# EAGLE schematic half (EAGLE 9.0.0)
COMPANY: ADAFRUIT INDUSTRIES; DRAWN: KTOWN; REV: B

## Sheet 1 of 3
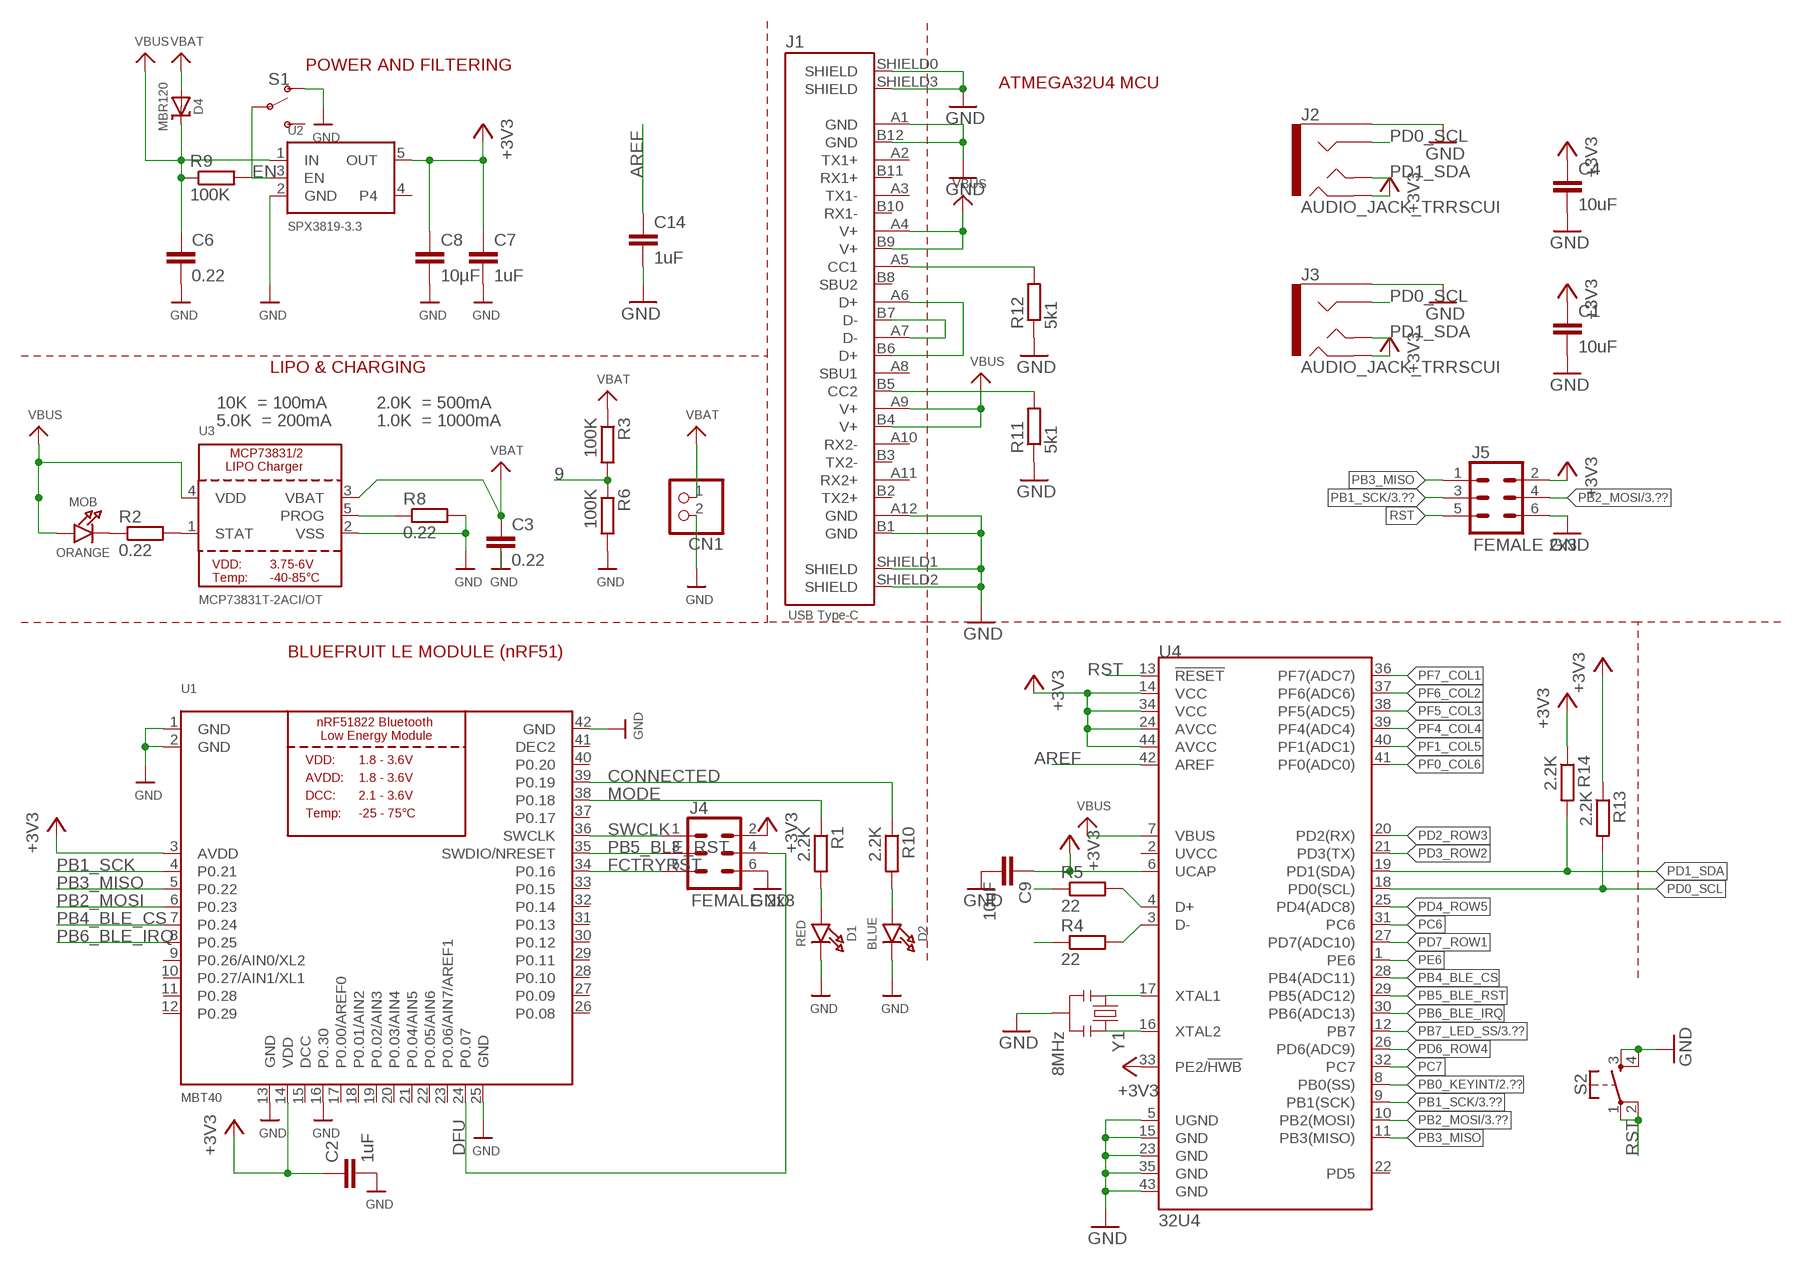
[diagram p0: schematic, sheet 1]

### Parts
C1  10uF  C-EUC0805  [C0805]
C2  1uF  C-EUC0805  [C0805]
C3  0.22  C-EUC0805  [C0805]
C4  10uF  C-EUC0805  [C0805]
C6  0.22  C-EUC0805  [C0805]
C7  1uF  C-EUC0805  [C0805]
C8  10µF  C-EUC0805  [C0805]
C9  10uF  C-EUC0805  [C0805]
C14  1uF  C-EUC0805  [C0805]
CN1  JST_2PIN-SMT-RA  [JST-PH-2-SMT-RA]
D1  RED  LED0805_NOOUTLINE  [CHIPLED_0805_NOOUTLINE]
D2  BLUE  LED0805_NOOUTLINE  [CHIPLED_0805_NOOUTLINE]
D4  MBR120  DIODE-SCHOTTKYSOD-123  [SOD-123]
J1  DX07S024JJ2_USB_TYPE-C  [DX07S0224JJ2_USB-C]
J2  AUDIO_JACK_TRRSCUI  [AUDIO_JACK_3.5MM_TRRS_SMD_CUI]
J3  AUDIO_JACK_TRRSCUI  [AUDIO_JACK_3.5MM_TRRS_SMD_CUI]
J4  FEMALE 2x3  CONN_03X2FEMALE  [2X3]
J5  FEMALE 2x3  CONN_03X2FEMALE  [2X3]
MOB  ORANGE  LED0805_NOOUTLINE  [CHIPLED_0805_NOOUTLINE]
R1  2.2K  R-EU_R0805  [R0805]
R2  0.22  R-EU_R0805  [R0805]
R3  100K  R-EU_R0805  [R0805]
R4  22  R-EU_R0805  [R0805]
R5  22  R-EU_R0805  [R0805]
R6  100K  R-EU_R0805  [R0805]
R8  0.22  R-EU_R0805  [R0805]
R9  100K  R-EU_R0805  [R0805]
R10  2.2K  R-EU_R0805  [R0805]
R11  5k1  R-EU_R0805  [R0805]
R12  5k1  R-EU_R0805  [R0805]
R13  2.2K  R-EU_R0805  [R0805]
R14  2.2K  R-EU_R0805  [R0805]
S1  SWITCH-SPDT-SMD-RIGHT-ANGLE  [SWITCH_SPST_SMD_A]
S2  MOMENTARY-SWITCH-SPST-2-SMD-5.2MM  [TACTILE_SWITCH_SMD_5.2MM]
U1  MBT40  NRF51822_MODULE_MDBT40  [BLE_MODULE_RAYTAC_MDBT40]
U2  SPX3819-3.3  VREG_SOT23-5  [SOT23-5]
U3  MCP73831T-2ACI/OT  MCP73831/2  [SOT23-5]
U4  32U4  ATMEGA32U4TQFP-44  [TQFP44]
Y1  8MHz  RESONATORSMD  [RESONATOR-SMD]

### Nets
9: R3.2 R6.1
+3V3: C1.1 C2.1 C4.1 C7.1 C8.1 C9.1 J2.RING2 J3.RING2 J4.2 J5.2 R13.1 R14.1 U1.3(AVDD) U1.14(VDD) U2.5(OUT) U4.6(UCAP) U4.14(VCC) U4.24(AVCC) U4.33(PE2/!HWB) U4.34(VCC) U4.44(AVCC) ; also sheet 2,3
AREF: C14.1 U4.42(AREF)
CONNECTED: R10.1 U1.39(P0.19)
D++: J1.A6(D+) J1.B6(D+) R5.1
D--: J1.A7(D-) J1.B7(D-) R4.1
DFU: J4.4 U1.24(P0.07)
EN: R9.2 S1.2(P) U2.3(EN)
FCTRYRST: J4.5 U1.34(P0.16)
GND: C1.2 C2.2 C3.2 C4.2 C6.2 C7.2 C8.2 C9.2 C14.2 CN1.2 D1.C D2.C J1.A1(GND) J1.A12(GND) J1.B1(GND) J1.B12(GND) J1.SHIELD0(SHIELD) J1.SHIELD1(SHIELD) J1.SHIELD2(SHIELD) J1.SHIELD3(SHIELD) J2.EARTH J3.EARTH J4.6 J5.6 R6.2 R8.2 R11.1 R12.1 S1.1(O) S2.3 S2.4 U1.1(GND) U1.2(GND) U1.13(GND) U1.16(P0.30) U1.25(GND) U1.42(GND) U2.2(GND) U3.2(VSS) U4.5(UGND) U4.15(GND) U4.23(GND) U4.35(GND) U4.43(GND) Y1.2 ; also sheet 3
MODE: R1.1 U1.38(P0.18)
N$1: MOB.C R2.1
N$3: R2.2 U3.1(STAT)
N$4: R8.1 U3.5(PROG)
N$5: D1.A R1.2
N$6: D2.A R10.2
N$7: U4.17(XTAL1) Y1.1
N$8: U4.16(XTAL2) Y1.3
N$9: R5.2 U4.4(D+)
N$10: R4.2 U4.3(D-)
N$11: J1.A5(CC1) R12.2
N$12: J1.B5(CC2) R11.2
PB0_KEYINT: U4.8(PB0(SS)) ; also sheet 2
PB1_SCK: J5.3 U1.4(P0.21) U4.9(PB1(SCK)) ; also sheet 3
PB2_MOSI: J5.4 U1.6(P0.23) U4.10(PB2(MOSI)) ; also sheet 3
PB3_MISO: J5.1 U1.5(P0.22) U4.11(PB3(MISO))
PB4_BLE_CS: U1.7(P0.24) U4.28(PB4(ADC11))
PB5_BLE_RST: J4.3 U1.35(SWDIO/NRESET) U4.29(PB5(ADC12))
PB6_BLE_IRQ: U1.8(P0.25) U4.30(PB6(ADC13))
PB7_LED_SS: U4.12(PB7) ; also sheet 3
PC6: U4.31(PC6)
PC7: U4.32(PC7)
PD0_SCL: J2.RING1 J3.RING1 R13.2 U4.18(PD0(SCL))
PD1_SDA: J2.TIP J3.TIP R14.2 U4.19(PD1(SDA))
PD2_ROW3: U4.20(PD2(RX)) ; also sheet 2
PD3_ROW2: U4.21(PD3(TX)) ; also sheet 2
PD4_ROW5: U4.25(PD4(ADC8)) ; also sheet 2
PD6_ROW4: U4.26(PD6(ADC9)) ; also sheet 2
PD7_ROW1: U4.27(PD7(ADC10)) ; also sheet 2
PE6: U4.1(PE6)
PF0_COL6: U4.41(PF0(ADC0)) ; also sheet 2
PF1_COL5: U4.40(PF1(ADC1)) ; also sheet 2
PF4_COL4: U4.39(PF4(ADC4)) ; also sheet 2
PF5_COL3: U4.38(PF5(ADC5)) ; also sheet 2
PF6_COL2: U4.37(PF6(ADC6)) ; also sheet 2
PF7_COL1: U4.36(PF7(ADC7)) ; also sheet 2
RST: J5.5 S2.1 S2.2 U4.13(!RESET)
SWCLK: J4.1 U1.36(SWCLK)
VBAT: C3.1 CN1.1 D4.A R3.1 U3.3(VBAT)
VBUS: C6.1 D4.C J1.A4(V+) J1.A9(V+) J1.B4(V+) J1.B9(V+) MOB.A R9.1 U2.1(IN) U3.4(VDD) U4.7(VBUS)
Unconnected: J1.A2(TX1+) J1.A3(TX1-) J1.A8(SBU1) J1.A10(RX2-) J1.A11(RX2+) J1.B2(TX2+) J1.B3(TX2-) J1.B8(SBU2) J1.B10(RX1-) J1.B11(RX1+) S1.3(S) U1.9(P0.26/AIN0/XL2) U1.10(P0.27/AIN1/XL1) U1.11(P0.28) U1.12(P0.29) U1.17(P0.00/AREF0) U1.18(P0.01/AIN2) U1.19(P0.02/AIN3) U1.20(P0.03/AIN4) U1.21(P0.04/AIN5) U1.22(P0.05/AIN6) U1.23(P0.06/AIN7/AREF1) U1.26(P0.08) U1.27(P0.09) U1.28(P0.10) U1.29(P0.11) U1.30(P0.12) U1.31(P0.13) U1.32(P0.14) U1.33(P0.15) U1.37(P0.17) U1.40(P0.20) U2.4 U4.2(UVCC) U4.22(PD5)

### Notes on the sheet
- POWER AND FILTERING
- ATMEGA32U4 MCU
- LIPO & CHARGING
- 10K  = 100mA | 2.0K  = 500mA
- 5.0K  = 200mA | 1.0K  = 1000mA
- BLUEFRUIT LE MODULE (nRF51)

## Sheet 2 of 3
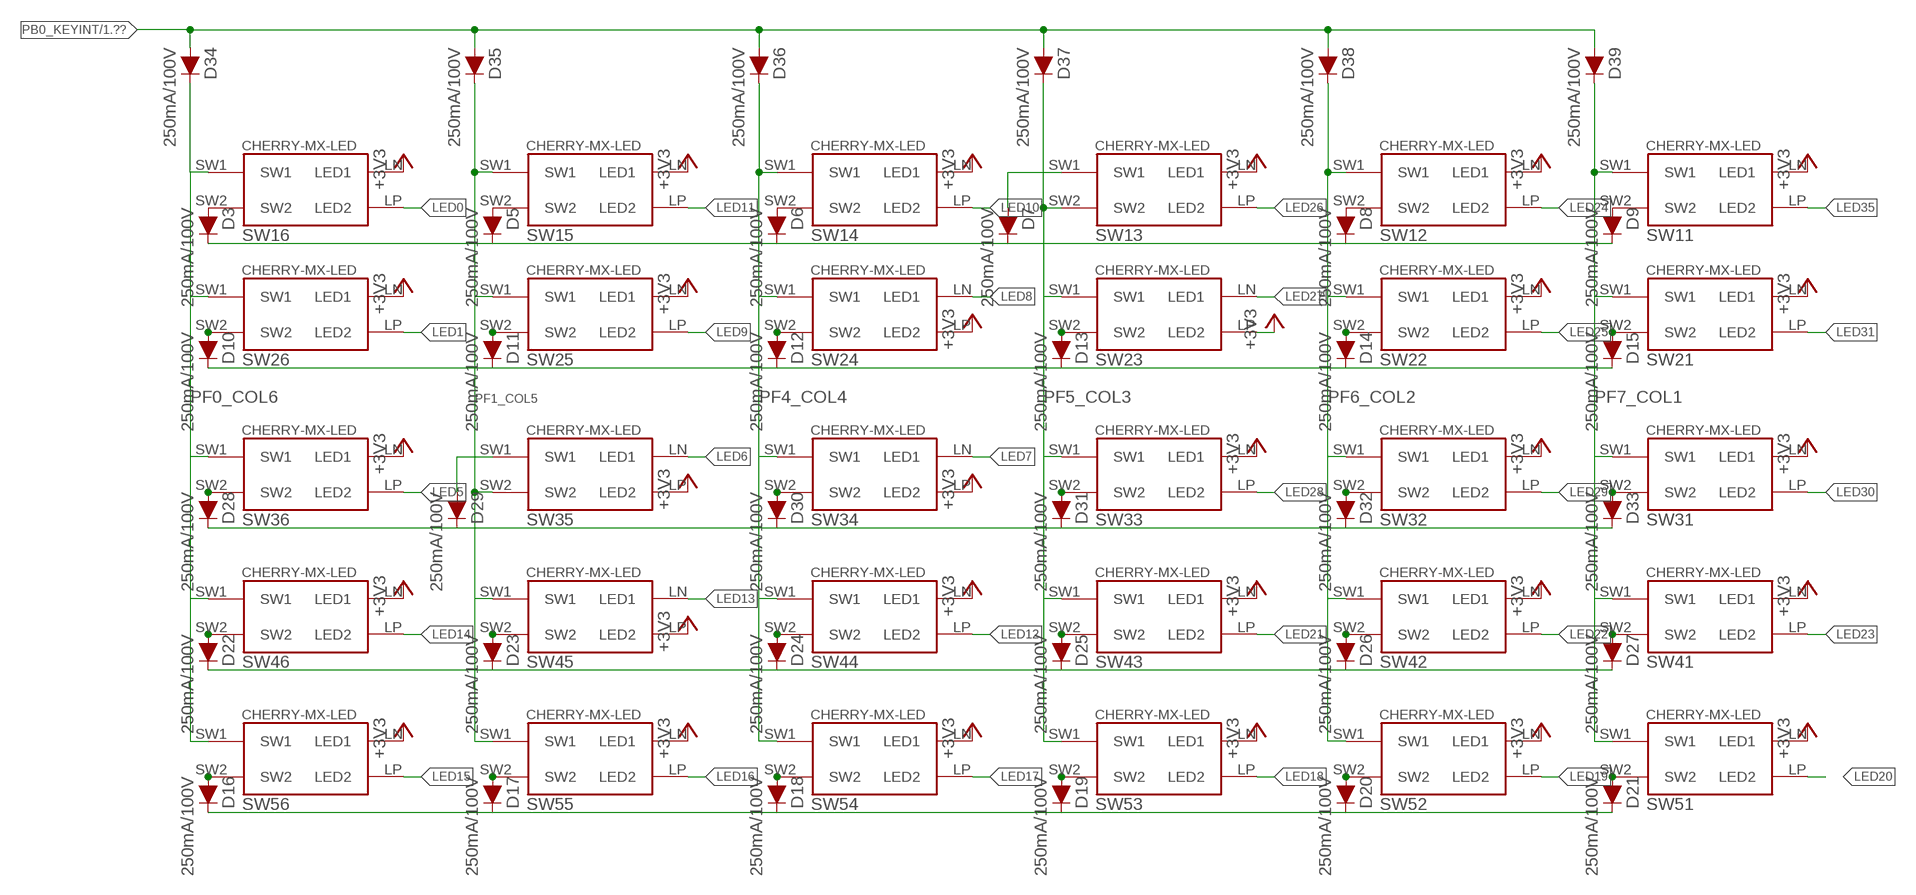
[diagram p1: schematic, sheet 2]

### Parts
D3  250mA/100V  DIODE-BAS16J  [SOD-323]
D5  250mA/100V  DIODE-BAS16J  [SOD-323]
D6  250mA/100V  DIODE-BAS16J  [SOD-323]
D7  250mA/100V  DIODE-BAS16J  [SOD-323]
D8  250mA/100V  DIODE-BAS16J  [SOD-323]
D9  250mA/100V  DIODE-BAS16J  [SOD-323]
D10  250mA/100V  DIODE-BAS16J  [SOD-323]
D11  250mA/100V  DIODE-BAS16J  [SOD-323]
D12  250mA/100V  DIODE-BAS16J  [SOD-323]
D13  250mA/100V  DIODE-BAS16J  [SOD-323]
D14  250mA/100V  DIODE-BAS16J  [SOD-323]
D15  250mA/100V  DIODE-BAS16J  [SOD-323]
D16  250mA/100V  DIODE-BAS16J  [SOD-323]
D17  250mA/100V  DIODE-BAS16J  [SOD-323]
D18  250mA/100V  DIODE-BAS16J  [SOD-323]
D19  250mA/100V  DIODE-BAS16J  [SOD-323]
D20  250mA/100V  DIODE-BAS16J  [SOD-323]
D21  250mA/100V  DIODE-BAS16J  [SOD-323]
D22  250mA/100V  DIODE-BAS16J  [SOD-323]
D23  250mA/100V  DIODE-BAS16J  [SOD-323]
D24  250mA/100V  DIODE-BAS16J  [SOD-323]
D25  250mA/100V  DIODE-BAS16J  [SOD-323]
D26  250mA/100V  DIODE-BAS16J  [SOD-323]
D27  250mA/100V  DIODE-BAS16J  [SOD-323]
D28  250mA/100V  DIODE-BAS16J  [SOD-323]
D29  250mA/100V  DIODE-BAS16J  [SOD-323]
D30  250mA/100V  DIODE-BAS16J  [SOD-323]
D31  250mA/100V  DIODE-BAS16J  [SOD-323]
D32  250mA/100V  DIODE-BAS16J  [SOD-323]
D33  250mA/100V  DIODE-BAS16J  [SOD-323]
D34  250mA/100V  DIODE-BAS16J  [SOD-323]
D35  250mA/100V  DIODE-BAS16J  [SOD-323]
D36  250mA/100V  DIODE-BAS16J  [SOD-323]
D37  250mA/100V  DIODE-BAS16J  [SOD-323]
D38  250mA/100V  DIODE-BAS16J  [SOD-323]
D39  250mA/100V  DIODE-BAS16J  [SOD-323]
SW11  CHERRY-MX-LEDSMD  [CHERRY-MX-PM-SMDLED]
SW12  CHERRY-MX-LEDSMD  [CHERRY-MX-PM-SMDLED]
SW13  CHERRY-MX-LEDSMD  [CHERRY-MX-PM-SMDLED]
SW14  CHERRY-MX-LEDSMD  [CHERRY-MX-PM-SMDLED]
SW15  CHERRY-MX-LEDSMD  [CHERRY-MX-PM-SMDLED]
SW16  CHERRY-MX-LEDSMD  [CHERRY-MX-PM-SMDLED]
SW21  CHERRY-MX-LEDSMD  [CHERRY-MX-PM-SMDLED]
SW22  CHERRY-MX-LEDSMD  [CHERRY-MX-PM-SMDLED]
SW23  CHERRY-MX-LEDSMD  [CHERRY-MX-PM-SMDLED]
SW24  CHERRY-MX-LEDSMD  [CHERRY-MX-PM-SMDLED]
SW25  CHERRY-MX-LEDSMD  [CHERRY-MX-PM-SMDLED]
SW26  CHERRY-MX-LEDSMD  [CHERRY-MX-PM-SMDLED]
SW31  CHERRY-MX-LEDSMD  [CHERRY-MX-PM-SMDLED]
SW32  CHERRY-MX-LEDSMD  [CHERRY-MX-PM-SMDLED]
SW33  CHERRY-MX-LEDSMD  [CHERRY-MX-PM-SMDLED]
SW34  CHERRY-MX-LEDSMD  [CHERRY-MX-PM-SMDLED]
SW35  CHERRY-MX-LEDSMD  [CHERRY-MX-PM-SMDLED]
SW36  CHERRY-MX-LEDSMD  [CHERRY-MX-PM-SMDLED]
SW41  CHERRY-MX-LEDSMD  [CHERRY-MX-PM-SMDLED]
SW42  CHERRY-MX-LEDSMD  [CHERRY-MX-PM-SMDLED]
SW43  CHERRY-MX-LEDSMD  [CHERRY-MX-PM-SMDLED]
SW44  CHERRY-MX-LEDSMD  [CHERRY-MX-PM-SMDLED]
SW45  CHERRY-MX-LEDSMD  [CHERRY-MX-PM-SMDLED]
SW46  CHERRY-MX-LEDSMD  [CHERRY-MX-PM-SMDLED]
SW51  CHERRY-MX-LEDSMD  [CHERRY-MX-PM-SMDLED]
SW52  CHERRY-MX-LEDSMD  [CHERRY-MX-PM-SMDLED]
SW53  CHERRY-MX-LEDSMD  [CHERRY-MX-PM-SMDLED]
SW54  CHERRY-MX-LEDSMD  [CHERRY-MX-PM-SMDLED]
SW55  CHERRY-MX-LEDSMD  [CHERRY-MX-PM-SMDLED]
SW56  CHERRY-MX-LEDSMD  [CHERRY-MX-PM-SMDLED]

### Nets
+3V3: SW11.LN(LED1) SW12.LN(LED1) SW13.LN(LED1) SW14.LN(LED1) SW15.LN(LED1) SW16.LN(LED1) SW21.LN(LED1) SW22.LN(LED1) SW23.LP(LED2) SW24.LP(LED2) SW25.LN(LED1) SW26.LN(LED1) SW31.LN(LED1) SW32.LN(LED1) SW33.LN(LED1) SW34.LP(LED2) SW35.LP(LED2) SW36.LN(LED1) SW41.LN(LED1) SW42.LN(LED1) SW43.LN(LED1) SW44.LN(LED1) SW45.LP(LED2) SW46.LN(LED1) SW51.LN(LED1) SW52.LN(LED1) SW53.LN(LED1) SW54.LN(LED1) SW55.LN(LED1) SW56.LN(LED1) ; also sheet 1,3
LED0: SW16.LP(LED2) ; also sheet 3
LED1: SW26.LP(LED2) ; also sheet 3
LED5: SW36.LP(LED2) ; also sheet 3
LED6: SW35.LN(LED1) ; also sheet 3
LED7: SW34.LN(LED1) ; also sheet 3
LED8: SW24.LN(LED1) ; also sheet 3
LED9: SW25.LP(LED2) ; also sheet 3
LED10: SW14.LP(LED2) ; also sheet 3
LED11: SW15.LP(LED2) ; also sheet 3
LED12: SW44.LP(LED2) ; also sheet 3
LED13: SW45.LN(LED1) ; also sheet 3
LED14: SW46.LP(LED2) ; also sheet 3
LED15: SW56.LP(LED2) ; also sheet 3
LED16: SW55.LP(LED2) ; also sheet 3
LED17: SW54.LP(LED2) ; also sheet 3
LED18: SW53.LP(LED2) ; also sheet 3
LED19: SW52.LP(LED2) ; also sheet 3
LED20: SW51.LP(LED2) ; also sheet 3
LED21: SW43.LP(LED2) ; also sheet 3
LED22: SW42.LP(LED2) ; also sheet 3
LED23: SW41.LP(LED2) ; also sheet 3
LED24: SW12.LP(LED2) ; also sheet 3
LED25: SW22.LP(LED2) ; also sheet 3
LED26: SW13.LP(LED2) ; also sheet 3
LED27: SW23.LN(LED1) ; also sheet 3
LED28: SW33.LP(LED2) ; also sheet 3
LED29: SW32.LP(LED2) ; also sheet 3
LED30: SW31.LP(LED2) ; also sheet 3
LED31: SW21.LP(LED2) ; also sheet 3
LED35: SW11.LP(LED2) ; also sheet 3
N$2: D29.A SW35.SW1
N$13: D3.A SW16.SW2
N$16: D5.A SW15.SW2
N$17: D6.A SW14.SW2
N$20: D7.A SW13.SW1
N$21: D8.A SW12.SW2
N$22: D9.A SW11.SW2
N$24: D10.A SW26.SW2
N$25: D11.A SW25.SW2
N$26: D12.A SW24.SW2
N$27: D13.A SW23.SW2
N$28: D14.A SW22.SW2
N$29: D15.A SW21.SW2
N$31: D16.A SW56.SW2
N$32: D17.A SW55.SW2
N$33: D18.A SW54.SW2
N$34: D19.A SW53.SW2
N$35: D20.A SW52.SW2
N$36: D21.A SW51.SW2
N$38: D22.A SW46.SW2
N$39: D23.A SW45.SW2
N$40: D24.A SW44.SW2
N$41: D25.A SW43.SW2
N$42: D26.A SW42.SW2
N$43: D27.A SW41.SW2
N$45: D28.A SW36.SW2
N$47: D30.A SW34.SW2
N$48: D31.A SW33.SW2
N$49: D32.A SW32.SW2
N$50: D33.A SW31.SW2
PB0_KEYINT: D34.A D35.A D36.A D37.A D38.A D39.A ; also sheet 1
PD2_ROW3: D28.C D29.C D30.C D31.C D32.C D33.C ; also sheet 1
PD3_ROW2: D10.C D11.C D12.C D13.C D14.C D15.C ; also sheet 1
PD4_ROW5: D16.C D17.C D18.C D19.C D20.C D21.C ; also sheet 1
PD6_ROW4: D22.C D23.C D24.C D25.C D26.C D27.C ; also sheet 1
PD7_ROW1: D3.C D5.C D6.C D7.C D8.C D9.C ; also sheet 1
PF0_COL6: D34.C SW16.SW1 SW26.SW1 SW36.SW1 SW46.SW1 SW56.SW1 ; also sheet 1
PF1_COL5: D35.C SW15.SW1 SW25.SW1 SW35.SW2 SW45.SW1 SW55.SW1 ; also sheet 1
PF4_COL4: D36.C SW14.SW1 SW24.SW1 SW34.SW1 SW44.SW1 SW54.SW1 ; also sheet 1
PF5_COL3: D37.C SW13.SW2 SW23.SW1 SW33.SW1 SW43.SW1 SW53.SW1 ; also sheet 1
PF6_COL2: D38.C SW12.SW1 SW22.SW1 SW32.SW1 SW42.SW1 SW52.SW1 ; also sheet 1
PF7_COL1: D39.C SW11.SW1 SW21.SW1 SW31.SW1 SW41.SW1 SW51.SW1 ; also sheet 1

## Sheet 3 of 3
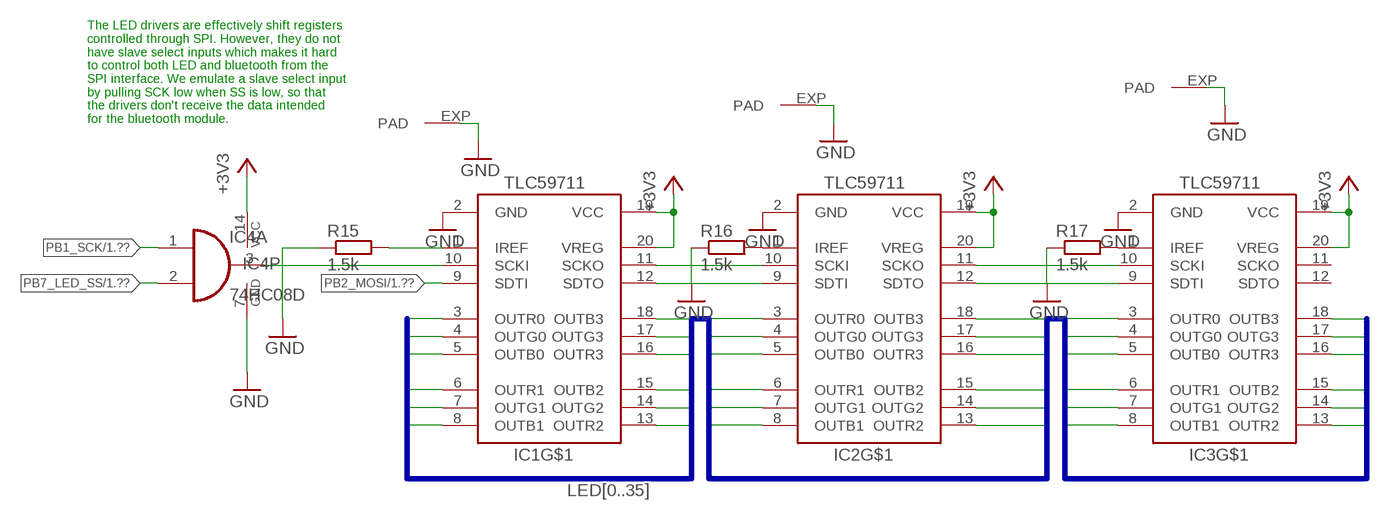
[diagram p2: schematic, sheet 3]

### Parts
IC1  TLC59711  [HTSSOP20DAP]
IC2  TLC59711  [HTSSOP20DAP]
IC3  TLC59711  [HTSSOP20DAP]
IC4  74HC08D  [SO14]
R15  1.5k  R-EU_R0805  [R0805]
R16  1.5k  R-EU_R0805  [R0805]
R17  1.5k  R-EU_R0805  [R0805]

### Nets
+3V3: IC1.19(VCC) IC1.20(VREG) IC2.19(VCC) IC2.20(VREG) IC3.19(VCC) IC3.20(VREG) IC4.14(P:VCC) ; also sheet 1,2
GND: IC1.2(GND) IC1.EXP(PAD) IC2.2(GND) IC2.EXP(PAD) IC3.2(GND) IC3.EXP(PAD) IC4.7(P:GND) R15.1 R16.1 R17.1 ; also sheet 1
LED0: IC1.3(OUTR0) ; also sheet 2
LED1: IC1.4(OUTG0) ; also sheet 2
LED2: IC1.5(OUTB0)
LED3: IC1.6(OUTR1)
LED4: IC1.7(OUTG1)
LED5: IC1.8(OUTB1) ; also sheet 2
LED6: IC1.13(OUTR2) ; also sheet 2
LED7: IC1.14(OUTG2) ; also sheet 2
LED8: IC1.15(OUTB2) ; also sheet 2
LED9: IC1.16(OUTR3) ; also sheet 2
LED10: IC1.17(OUTG3) ; also sheet 2
LED11: IC1.18(OUTB3) ; also sheet 2
LED12: IC2.3(OUTR0) ; also sheet 2
LED13: IC2.4(OUTG0) ; also sheet 2
LED14: IC2.5(OUTB0) ; also sheet 2
LED15: IC2.6(OUTR1) ; also sheet 2
LED16: IC2.7(OUTG1) ; also sheet 2
LED17: IC2.8(OUTB1) ; also sheet 2
LED18: IC2.13(OUTR2) ; also sheet 2
LED19: IC2.14(OUTG2) ; also sheet 2
LED20: IC2.15(OUTB2) ; also sheet 2
LED21: IC2.16(OUTR3) ; also sheet 2
LED22: IC2.17(OUTG3) ; also sheet 2
LED23: IC2.18(OUTB3) ; also sheet 2
LED24: IC3.3(OUTR0) ; also sheet 2
LED25: IC3.4(OUTG0) ; also sheet 2
LED26: IC3.5(OUTB0) ; also sheet 2
LED27: IC3.6(OUTR1) ; also sheet 2
LED28: IC3.7(OUTG1) ; also sheet 2
LED29: IC3.8(OUTB1) ; also sheet 2
LED30: IC3.13(OUTR2) ; also sheet 2
LED31: IC3.14(OUTG2) ; also sheet 2
LED32: IC3.15(OUTB2)
LED33: IC3.16(OUTR3)
LED34: IC3.17(OUTG3)
LED35: IC3.18(OUTB3) ; also sheet 2
LEDDAT2: IC1.12(SDTO) IC2.9(SDTI)
LEDDAT3: IC2.12(SDTO) IC3.9(SDTI)
LEDSCK1: IC1.10(SCKI) IC4.3(A:O)
LEDSCK2: IC1.11(SCKO) IC2.10(SCKI)
LEDSCK3: IC2.11(SCKO) IC3.10(SCKI)
N$86: IC1.1(IREF) R15.2
N$87: IC3.1(IREF) R17.2
N$89: IC2.1(IREF) R16.2
PB1_SCK: IC4.1(A:I0) ; also sheet 1
PB2_MOSI: IC1.9(SDTI) ; also sheet 1
PB7_LED_SS: IC4.2(A:I1) ; also sheet 1
Unconnected: IC3.11(SCKO) IC3.12(SDTO) IC4.4(B:I0) IC4.5(B:I1) IC4.6(B:O) IC4.8(C:O) IC4.9(C:I0) IC4.10(C:I1) IC4.11(D:O) IC4.12(D:I0) IC4.13(D:I1)

### Buses
LED[0..35]

### Notes on the sheet
- The LED drivers are effectively shift registers 
  controlled through SPI. However, they do not
  have slave select inputs which makes it hard
  to control both LED and bluetooth from the 
  SPI interface. We emulate a slave select input
  by pulling SCK low when SS is low, so that
  the drivers don't receive the data intended
  for the bluetooth module.

## Power pins joined to a net without a drawn wire
DCC: U1.15(DCC)
DEC2: U1.41(DEC2)

## Library data of the parts
C1-C4 C6-C9 C14 = resistor:C-EU: CAPACITOR, European symbol
CN1 = adafruit:JST_2PIN: JST 2-Pin Connectors of various flavors SMT-RA (S2B-PH-SM4) 4UConnector #17311 SMT (B2B-PH-SM4) THM-RA (S2B-PH) THM (B2B-PH)
D1 D2 MOB = microbuilder:LED: LED 0603 - 0603 Surface Mount Package 2mA: Green LED - Low Power (3.9mcd, 2ma, 1.7Vf) - Digikey: 475-2709-2-ND Orange LED - Low Power (9.8mcd, 2ma, 1.8Vf) - Digikey: 475-1194-2-ND Red LED - Low Power (5mcd, 2ma, 1.8Vf) - Digikey: 475-1195-2-ND Yellow LED - Low Power (7mcd, 2ma, 1.8Vf) - Digikey: 475-1196-2-ND 5mA: Blue LED - Low Power (17mcd, 5ma, 2.9Vf) - Digikey: LNJ937W8CRACT-ND 0805 - 0805 Surface Mount Package 2mA: Red LED (8.8mcd, 2mA, 1.8Vf, Clear) - Low Power [Digikey: 475-2510-1-ND] Green LED (5mcd, 2mA, 1.8Vf, Clear) - Low Power [Digikey: 475-2730-1-ND] Yellow LED (11.3mcd, 2mA, 1.8Vf, Clear) - Low Power [Digikey: 475-2555-1-ND] 20mA: Red LED (104mcd, 20mA, Diffused) - LS R976 [Digikey: 475-1278-6-ND] Red LED (12mcd, 20mA, 2.0Vf, Clear) - APT2012EC [Digikey: 754-1128-1-ND] Green LED (15mcd, 20mA, 2.2Vf, Clear) - APT2012GC [Digikey: 754-1131-1-ND] Orange LED (160mcd, 20mA, 2.1Vf, Clear) - APT2012SECK [Digikey: 754-1130-1-ND] 1206 - 1206 Surface Mount Package Green LED (26mcd, 20mA, Diffused) - LG N971 [Digikey: 475-1407-6-ND] Red LED (15mcd, 20mA, Diffused) - LH N974 [Digikey: 475-1416-6-ND] Cree - Cree High-Power Surface Mount LEDs XPEBWT-L1-0000-00D50 - White 111lm 350mA 2.9Vf 6200K 110° XTEAWT-00-0000-00000LEE3 - White 114lm 350mA 2.85Vf 5000K 115° Everlight - Everlight 45-21 Series Surface Mount LEDs 45-21/QK2C-B2832AC2CB2/2T - Warm White 2000mcd 20mA 3.25Vf 3050K 120° 45-21/LK2C-B38452C4CB2/2T - Nuetral White 2000mcd 20mA 3.25Vf 4150K 120° 45-21/LK2C-B50634C6CB2/2T - Cold White 2200mcd 20mA 3.25Vf 5650K 120° PLCC2 Reverse Mount LS T77K-J1L2-1-0-2-R18-Z - Red 11.25mcd 2mA 1.8Vf 630nm 120° LO T77K-L1M2-24-Z - Orange 19.6mcd 2mA 1.8Vf 606nm 120° LY T77K-K2M1-26-Z - Yellow 15.7mcd 2mA 1.8Vf 587nm 120°
D3 D5-D39 = SparkFun-DiscreteSemi:DIODE: Diode These are standard reverse protection diodes and small signal diodes. SparkFun Products: SparkFun SparkPunk Sound Kit <https://www.sparkfun.com/products/11177> SparkFun ESP8266 Thing <https://www.sparkfun.com/products/13231>; PROD_ID: DIO-09646
D4 = microbuilder:DIODE-SCHOTTKY
IC1-IC3 = adafruit:TLC59711
IC4 = 74xx-eu:74*08: Quad 2-input AND gate
J1 = Tristan+Robitaille's+Library:DX07S024JJ2_USB_TYPE-C: JAE DX07S024JJ2 USB Type-C Connector ***Footprint contains plated drill holes (2mm diameter) instead of plated slots (easier on fabhouse)*** Technical Specifications: Mating cycles: 10,000 times Contact resistance: 40mΩ (max.) Rated current: 1.25A (max.) on pins A1, A4, A9, A12, B1, B4, B5, B9 and B12 0.25A (max.) on others Rated voltage: 20Vrms Datasheet <https://www.jae.com/z-en/pdf_download_exec.cfm?param=MB-0297-3E_DX07.pdf> Digi-Key part #: 670-2794-6-ND <http://www.digikey.com/product-detail/en/jae-electronics/DX07S024JJ2R1300/670-2794-6-ND/5246069> Mouser part #: 656-DX07S024JJ2R1300 <http://ca.mouser.com/ProductDetail/JAE-Electronics/DX07S024JJ2R1300/?qs=%2fha2pyFaduhsAyGD7ZqdDeHjVi4g0c8wrw%252bV08Os%252brQ5DqW1EY3Lew%3d%3d> Manufacturer part #: DX07S024JJ2R1300; DIGIKEY#: 670-2794-6-ND; MANF: USB Type-C DX07 Series Receptacle; MANF#: DX07S024JJ2R1300; MOUSER#: 656-DX07S024JJ2R1300
J2 J3 = cui:AUDIO_JACK_TRRS: Audio Jack - 3.5mm TRRS (SMD) This is a 3.5mm TRRS SMD audio jack. TRRS connectors are the audio-style connectors that you see on some phones, MP3 players and development boards. TRRS stands for “tip, ring, ring, sleeve,” which reflects that this has three conductors and a ground. SparkFun Products: Audio Jack <https://www.sparkfun.com/products/12639> mbed Starter Kit <https://www.sparkfun.com/products/12968> SparkFun TRRS 3.5mm Jack Breakout <https://www.sparkfun.com/products/11570>
J4 J5 = SparkFun-Connectors:CONN_03X2: Multi connection point. Often used as Generic Header-pin footprint for 0.1 inch spaced/style header connections You can populate with any combo of single row headers, but if you'd like an exact match, check these: Header - 2x3 (Male, 0.1") <https://www.sparkfun.com/products/12807> (PRT-12807) Header - 2x3 (Female, 0.1") <https://www.sparkfun.com/products/13010> (PRT-13010) 2x3 Pin Shrouded Header <https://www.sparkfun.com/products/10877> (PRT-10877) On any of the 0.1 inch spaced packages, you can populate with these: Break Away Headers - Straight <https://www.sparkfun.com/products/116> (PRT-00116) Break Away Male Headers - Right Angle <https://www.sparkfun.com/products/553> (PRT-00553) Female Headers <https://www.sparkfun.com/products/115> (PRT-00115) Break Away Headers - Machine Pin <https://www.sparkfun.com/products/117> (PRT-00117) Break Away Female Headers - Swiss Machine Pin <https://www.sparkfun.com/products/743> (PRT-00743) Special note: the shrouded connector mates well with our 3x2 ribbon cables: Ribbon Crimp Connector - 6-pin (2x3, Female) <https://www.sparkfun.com/products/10651> (PRT-10651) Ribbon Cable - 6 wire (15ft) <https://www.sparkfun.com/products/10646> (PRT-10646); PROD_ID: CONN-11566
R1-R6 R8-R17 = resistor:R-EU_: RESISTOR, European symbol
S1 = SparkFun-Switches:SWITCH-SPDT: Single Pole, Double Throw (SPDT) Switch Single-pole, double-throw (SPDT) switch. Variant Overview SMD-AYZ0202 Surface Mount DPDT Switch <https://www.sparkfun.com/products/597> (COM-00597) Used on e.g. LilyPad Arduino USB - ATmega32U4 Board <https://www.sparkfun.com/products/12049> PTH-11.6X4.0MM SPDT Mini Power Switch <https://www.sparkfun.com/products/102> (COM-00102) Used on e.g. SparkFun Simon Says - Through-Hole Soldering Kit <https://www.sparkfun.com/products/10547> (KIT-10547) PTH-11.6X4.0MM-KIT KIT version of SPDT Mini Power Switch - Simplifies soldering by removing tStop of switch pins - only one side can be soldered. PTH-11.6X4.0MM-LOCK LOCK version of SPDT Mini Power Switch - Offset pins hold switch in place for easier soldering. SMD-RIGHT-ANGLE Surface Mount Right Angle Switch <https://www.sparkfun.com/products/10860> (COM-10860) Used on e.g. SparkFun ESP8266 Thing <https://www.sparkfun.com/products/13231>; PROD_ID: SWCH-10651; SF_SKU: COM-10860
S2 = SparkFun-Switches:MOMENTARY-SWITCH-SPST-2: Momentary Switch (Pushbutton) - SPST - Two Circuits Normally-open (NO) SPST momentary switches (buttons, pushbuttons). Schematic symbol includes two switch circuits. Variants SMD-4.6MMX2.8MM - 4.60mm x 2.80mm Tactile Momentary Button Switch - Used on SparkFun SAMD21 Mini Breakout <https://www.sparkfun.com/products/13664> SMD-5.2MM - Mini Pushbutton Switch - SMD <https://www.sparkfun.com/products/8720> - Used on Arduino Pro Mini <https://www.sparkfun.com/products/11114>; PROD_ID: SWCH-08247; SF_SKU: COM-08720
SW11-SW16 SW21-SW26 SW31-SW36 SW41-SW46 SW51-SW56 = cherrymx:CHERRY-MX-LED: Cherry MX series keyswitch with LED
U1 = microbuilder:NRF51822_MODULE_MDBT40: nRF51822 Bluetooth Low Energy Module
U2 = microbuilder:VREG_SOT23-5: SOT23-5 Fixed Voltage Regulators Part Current Out V Out V In V Dropout θJA (°C/W) TJ (°C) Digikey Part No. ADP121 150mA 3.3V 3.4-5.5V 0.09V @ 150mA -- -- ADP121-AUJZ33R7CT-ND ADP121 150mA 3.0V 3.1-5.5V 0.09V @ 150mA -- -- ADP121-AUJZ30R7CT-ND ADP122 300mA 3.3V 3.4-5.5V 0.085V @ 300mA -- -- ADP122AUJZ-3.3-R7CT-ND ADP1712 300mA 3.3V 3.5-5.5V 0.17V @ 300mA -- -- ADP1712AUJZ-3.3-R7TR-ND AP7311 (Low Cost) 150mA 3.3V 3.5-6V 0.15V @ 150mA -- -- AP7311-33WG-7DICT-ND LD39015M18R 150mA 1.8V 1.9V-5.5V 0.08V @ 100mA -- -- 497-6977-1-ND LP2985A-33DBVR 150mA 3.3V 3.3-16V 0.28V @ 150mA 206 150 296-18479-1-ND MCP1824T-3302E/OT 300mA 3.3V 3.5V-6V 0.2V @ 300mA -- -- MCP1824T-3302E/OTCT-ND MIC5205-2.5YM5 TR 150mA 2.5V 2.7-16V 0.165V @ 150mA -- -- 576-1257-2-ND MIC5205-3.0YM5 TR 150mA 3.0V 3.2V-16V 0.165V @ 150mA -- -- 576-1258-2-ND MIC5205-3.3YM5 TR 150mA 3.3V 3.5V-16V 0.165V @ 150mA -- -- 576-1259-2-ND TPS780330220 150mA 3.3V+2.2V 3.6-5.5V 250mV Max -- -- 296-23332-1-ND TDA3663/N1,135 100mA 3.3V 3.5-45V 0.18V @ 50mA -- -- 568-5343-1-ND Max operating temp can be calculated using θJA, TJ (max junction temperature), and power in watts. Set the "Maximum Ambient Temperature" until it reaches TJ ("Max Junction Temperature"), which is the absolute limit for safe use of the regulator: Heat Sink Temperature Calculator <http://www.daycounter.com/Calculators/Heat-Sink-Temperature-Calculator.phtml> For example, With 12V source into a 3.3V LP2985 and a 30mA load, we are dissipating (12V-3.3V) * 0.03A = 0.261W. With a θJA of 206 °C/W, a TJ of 150°C, and 261mW we can safely use the chip without a heat sink up to 75°C (=147.1°C Junction Temperature).
U3 = microbuilder:MCP73831/2: MCP73831/2 LIPO Charger VDD: 3.75 - 6V Temp -40 - 85°C Programmable Charge Rate: 15-500mA NOTE: STAT is a tri-state logic output on the MCP73831 and an open-drain output on the MCP73832. SOT23-5 with 4.2V output and tri-state logic on STAT = MCP73831T-2ACI/OT
U4 = SparkFun-IC-Microcontroller:ATMEGA32U4: Atmel MCU, 32KByte Atmel 44-pin 8-bit Microcontroller with 32KBytes of ISP Flash and USB Controller Datasheet <http://cdn.sparkfun.com/datasheets/Dev/Arduino/Boards/ATMega32U4.pdf> SparkFun Products LilyPad Arduino USB - ATmega32U4 Board <https://www.sparkfun.com/products/12049> (DEV-12049) Pro Micro - 5V/16MHz <https://www.sparkfun.com/products/12640> (DEV-12640) Pro Micro - 3.3V/8MHz <https://www.sparkfun.com/products/12587> (DEV-12587) Fio v3 - ATmega32U4 <https://www.sparkfun.com/products/11520> (DEV-11520) Qduino Mini <https://www.sparkfun.com/products/13614> (DEV-13614) Makey Makey - Standard Kit <https://www.sparkfun.com/products/11511> (WIG-11511) Makey Makey Deluxe Kit <https://www.sparkfun.com/products/11519> (WIG-11519); PROD_ID: IC-11161
Y1 = SparkFun:RESONATOR: Resonator Small SMD resonator. This is the itty bitty 10/20MHz resonators with built in caps. CSTCE10M0G55 and CSTCE20M0V53. Footprint has been reviewed closely but hasn't been tested yet.